# Altium schematic sheet WX0.010.218DL.SchDoc
size A3
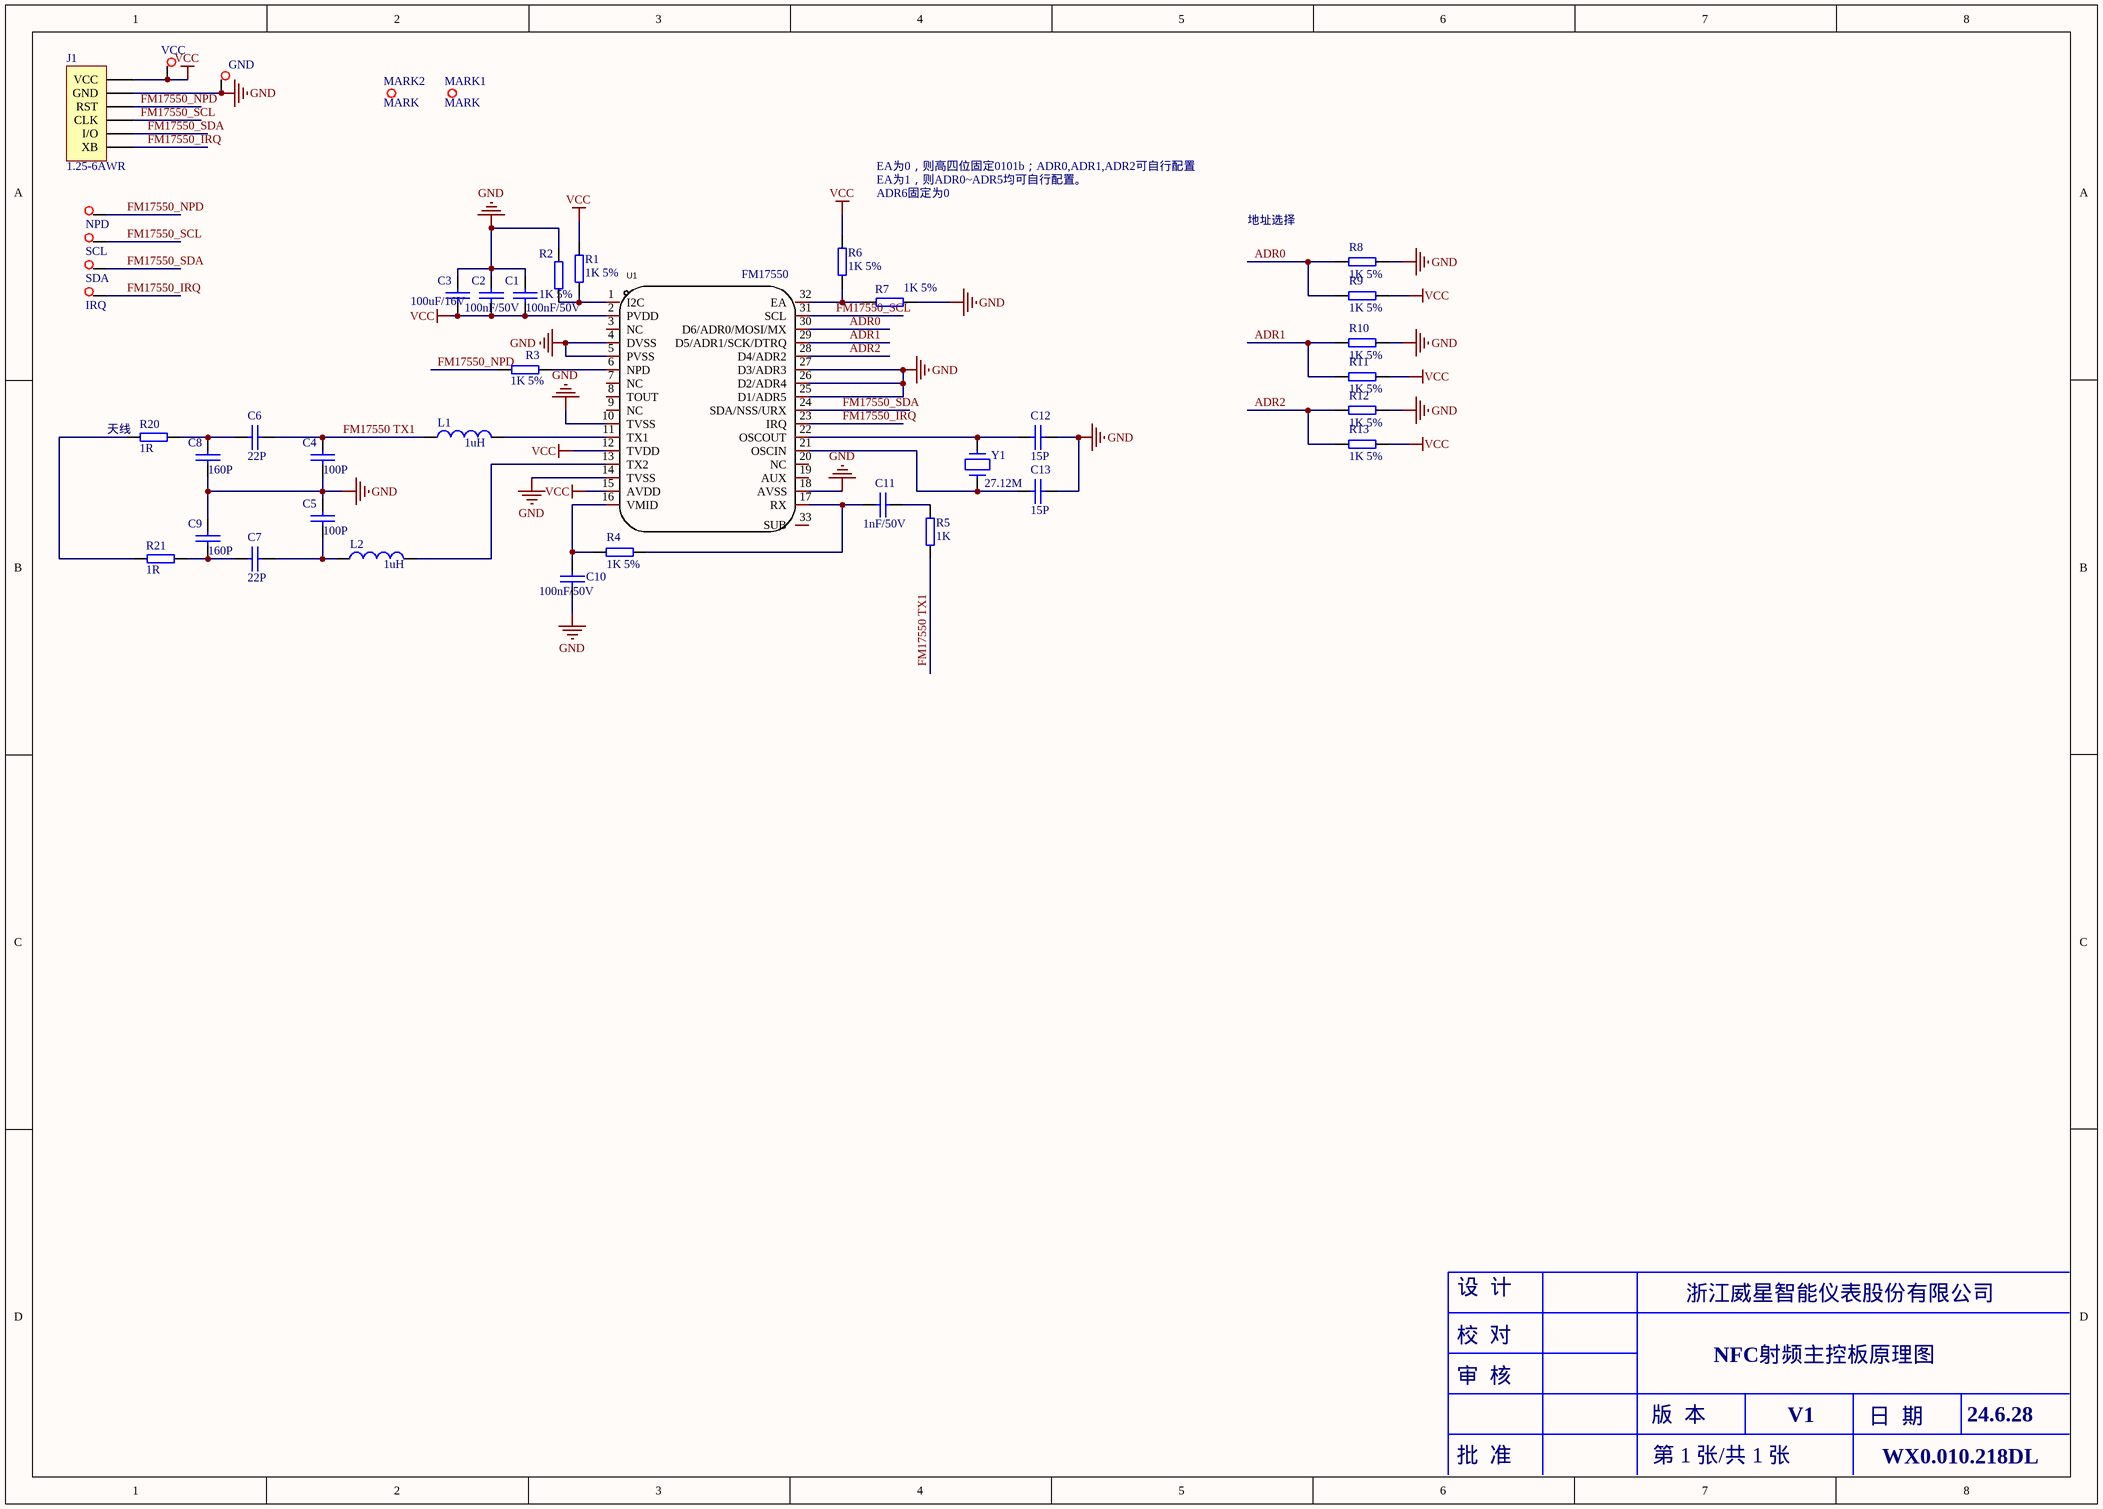
[diagram p0: WX0.010.218DL.SchDoc]

## Parts
C1  100nF/50V  [CAP0603]
C2  100nF/50V  [CAP0603]
C3  100uF/16V  [GRM31CR60J107ME39L]
C4  100P  [CAP0603]
C5  100P  [CAP0603]
C6  22P  [CAP0603]
C7  22P  [CAP0603]
C8  160P  [CAP0603]
C9  160P  [CAP0603]
C10  100nF/50V  [CAP0603]
C11  1nF/50V  [CAP0603]
C12  15P  [CAP0603]
C13  15P  [CAP0603]
GND  TEST-PAD  [TEST-PAD]  (value not drawn)
IRQ  TEST-PAD  [TEST-PAD]  (value not drawn)
J1  1.25-6AWR  [SMT-1.25-6]
L1  value 1uH  [L0805]  (hidden comment: Inductor)
L2  value 1uH  [L0805]  (hidden comment: Inductor)
MARK1  MARK  [MARK]
MARK2  MARK  [MARK]
NPD  TEST-PAD  [TEST-PAD]  (value not drawn)
R1  1K 5%  [RES0603]
R2  1K 5%  [RES0603]
R3  1K 5%  [RES0603]
R4  1K 5%  [RES0603]
R5  1K  [RES0603]
R6  1K 5%  [RES0603]
R7  1K 5%  [RES0603]
R8  1K 5%  [RES0603]
R9  1K 5%  [RES0603]
R10  1K 5%  [RES0603]
R11  1K 5%  [RES0603]
R12  1K 5%  [RES0603]
R13  1K 5%  [RES0603]
R20  1R  [RES0603]
R21  1R  [RES0603]
SCL  TEST-PAD  [TEST-PAD]  (value not drawn)
SDA  TEST-PAD  [TEST-PAD]  (value not drawn)
U1  FM17550  [QFN-32_L5.0-W5.0-P0.50-BL-EP3.7]
VCC  TEST-PAD  [TEST-PAD]  (value not drawn)
Y1  27.12M  [SX-3225]

## Nets
GND: C1.2 C2.2 C3.1 C4.1 C5.2 C8.1 C9.2 C10.2 C12.2 C13.2 GND.1 J1.5(GND) R2.2 R7.1 R8.2 R10.2 R12.2 U1.4(DVSS) U1.5(PVSS) U1.10(TVSS) U1.14(TVSS) U1.18(AVSS) U1.25(D1/ADR5) U1.26(D2/ADR4) U1.27(D3/ADR3)
VCC: C1.1 C2.1 C3.2 J1.6(VCC) R1.2 R6.1 R9.2 R11.2 R13.2 U1.2(PVDD) U1.12(TVDD) U1.15(AVDD) VCC.1
ADR0: R8.1 R9.1 U1.30(D6/ADR0/MOSI/MX)
ADR1: R10.1 R11.1 U1.29(D5/ADR1/SCK/DTRQ)
ADR2: R12.1 R13.1 U1.28(D4/ADR2)
FM17550 TX1: C4.2 C6.1 L1.1 R5.1
FM17550_IRQ: IRQ.1 J1.1(XB) U1.23(IRQ)
FM17550_NPD: J1.4(RST) NPD.1 R3.2
FM17550_SCL: J1.3(CLK) SCL.1 U1.31(SCL)
FM17550_SDA: J1.2(I/O) SDA.1 U1.24(SDA/NSS/URX)
NetC5_1: C5.1 C7.1 L2.1
NetC6_2: C6.2 C8.2 R20.1
NetC7_2: C7.2 C9.1 R21.1
NetC10_1: C10.1 R4.1 U1.16(VMID)
NetC11_1: C11.1 R4.2 U1.17(RX)
NetC11_2: C11.2 R5.2
NetC12_1: C12.1 U1.22(OSCOUT) Y1.3
NetC13_1: C13.1 U1.21(OSCIN) Y1.1
NetL1_2: L1.2 U1.11(TX1)
NetL2_2: L2.2 U1.13(TX2)
NetR1_1: R1.1 R2.1 U1.1(I2C)
NetR3_1: R3.1 U1.6(NPD)
NetR6_2: R6.2 R7.2 U1.32(EA)
NetR20_2: R20.2 R21.2

Not connected (* = marked no-connect by the designer): U1 3(NC) 7(NC) 8(TOUT) 9(NC) 19(AUX) 20(NC) 33(SUB)

## Notes on the sheet
- EA为0，则高四位固定0101b；ADR0,ADR1,ADR2可自行配置
- EA为1，则ADR0~ADR5均可自行配置。
- ADR6固定为0
- 地址选择
- (near R20) 天线
- 设  计
- 浙江威星智能仪表股份有限公司
- 审  核
- 校  对
- NFC射频主控板原理图
- 批  准
- 版  本
- 第 1 张/共 1 张
- V1
- 日  期
- 24.6.28
- WX0.010.218DL

## Library data of the parts
C1 C2 C4-C13 = 101020103-0021: 104pF,50 V,±10%,0603,国巨,CC0603KRX7R9BB104; Part Name: 0603贴片电容; ID: 3; SMD/DIP: SMD; Part Number: 101020103-0021
C3 = 101020101-0005: 100u,16 V,±10%,1206,国巨,CC1206KRNPO7BN106P; Part Name: 1206贴片电容; ID: 9; SMD/DIP: SMD
GND IRQ NPD SCL SDA VCC = AD_WXHJ_TEST-PAD_01: 单面焊盘测试点; Part Name: 测试点; ID: 23; SMD/DIP: SMD; Part Number: AD_WXHJ_TEST-PAD_01
J1 = 1010902-0121: 1.25-6AWR 卷,6针1.25mm,母头,单排,贴片卧式; Part Name: 插座; ID: 32; SMD/DIP: SMD; Part Number: 1010902-0121
L1 L2 = Inductor: Code_IEC: 1005; Published: 8-Jun-2000; LatestRevisionDate: 17-Jul-2002; LatestRevisionNote: Re-released for DXP Platform.; PackageReference: 0402-A; Publisher: Altium Limited; Code_JEITA: 0402
MARK1 MARK2 = AD_WXHJ_MARK_01: MARK点; ID: 8; SMD/DIP: SMD; Part Number: AD_WXHJ_MARK_01; Part Name: MARK点
R1-R13 = 101010103-0008: 1K,±5%,1/10W,0603,国巨,RC0603JR-071KL; Part Name: 0603贴片电阻; ID: 9; SMD/DIP: SMD; Part Number: 101010103-0008
R20 R21 = 101010103-0003: 国巨,±5%,0603,,155 ℃,-55 ℃,RC0603J2-070RL,无铅,200 ppm/℃,1/10W,,0R; Part Number: 101010103-0001; Part Name: 0603贴片电阻; ID: 7; SMD/DIP: SMD
U1 = FM17550: Manufacturer: FM(����΢); Value: 13.56MHz; Add into BOM: yes; agreement: ISO 14443A,ISO 14443B; interface type: SPI,UART,I2C,HOST; transmission rate: 106Kbps��424Kbps��212Kbps; mains input: 2.5V~3.6V; Symbol: FM17550; Device: FM17550; Supplier: LCSC; Manufacturer Part: FM17550; Supplier Part: C97597; JLCPCB Part Class: Extended Part; LCSC Part Name: 13.56MHz��ͨ�÷ǽӴ�ͨѶоƬ D�汾; Supplier Footprint: QFN-32-EP(5x5); Datasheet: https://atta.szlcsc.com/upload/public/pdf/source/20210615/C97597_4956CD9F2578B752A5E6C7FD495AFA9F.pdf; Convert to PCB: yes
Y1 = 04_XTALSG12MD_32.768kD: SCX3215(SCX3213089);32.768kHz;精度20%;负载电容12.5pF,3215,32.768kHz,0.03 ppm/℃,无源,Q-SC32S03220C5AAAF,SCX3215; Part Number: 1010601-0009; Part Name: 贴片晶振; ID: 19; SMD/DIP: SMD